# Altium project PCB_Vita.PrjPCB
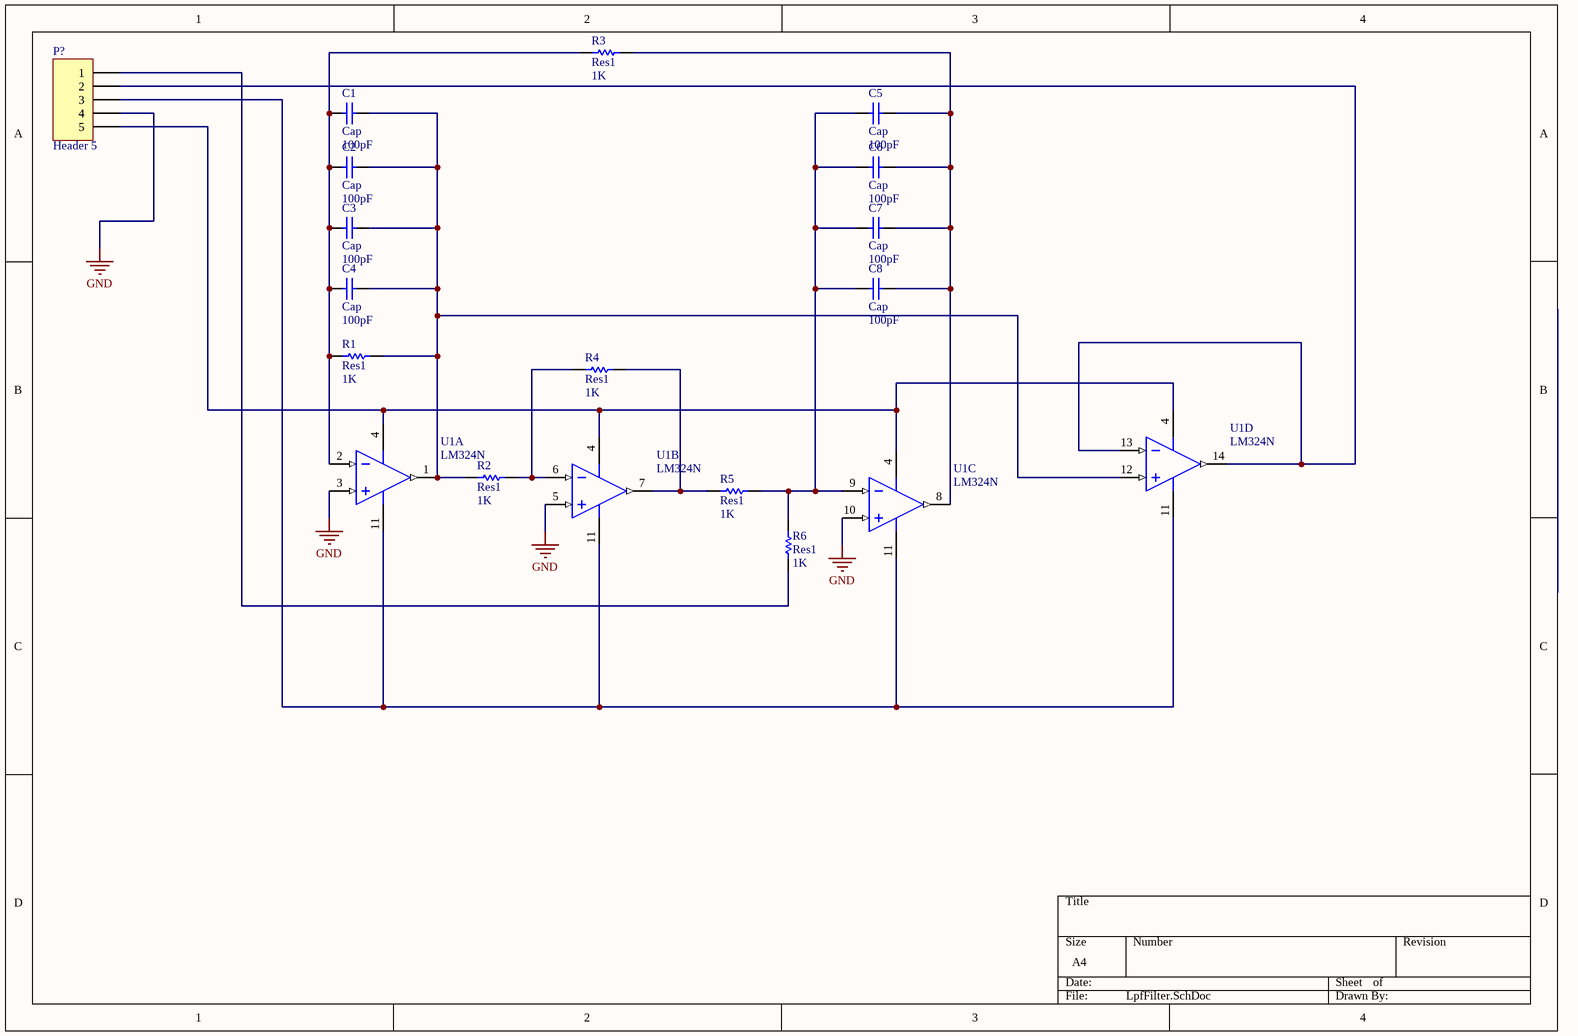
[diagram p0: LpfFilter.SchDoc]
1 sheet, 16 parts. Net scope: global (net labels, ports and power ports of the same name join across sheets).
Board file: LpfFilter.PcbDoc

## Sheet LpfFilter.SchDoc
size A4

### Parts
C1  Cap  value 100pF  [RAD-0.3]
C2  Cap  value 100pF  [RAD-0.3]
C3  Cap  value 100pF  [RAD-0.3]
C4  Cap  value 100pF  [RAD-0.3]
C5  Cap  value 100pF  [RAD-0.3]
C6  Cap  value 100pF  [RAD-0.3]
C7  Cap  value 100pF  [RAD-0.3]
C8  Cap  value 100pF  [RAD-0.3]
P?  Header 5  [HDR1X5]
R1  Res1  value 1K  [AXIAL-0.3]
R2  Res1  value 1K  [AXIAL-0.3]
R3  Res1  value 1K  [AXIAL-0.3]
R4  Res1  value 1K  [AXIAL-0.3]
R5  Res1  value 1K  [AXIAL-0.3]
R6  Res1  value 1K  [AXIAL-0.3]
U1  LM324N  [N14A]  (parts A,B,C,D of 4)

### Nets
GND: P?.4 U1.3(IN1+) U1.5(IN2+) U1.10(IN3+)
NetC1_1: C1.1 C2.1 C3.1 C4.1 R1.1 R3.1 U1.2(IN1-)
NetC1_2: C1.2 C2.2 C3.2 C4.2 R1.2 R2.1 U1.1(OUT1) U1.12(IN4+)
NetC5_1: C5.1 C6.1 C7.1 C8.1 R5.2 R6.2 U1.9(IN3-)
NetC5_2: C5.2 C6.2 C7.2 C8.2 R3.2 U1.8(OUT3)
NetP?_1: P?.1 R6.1
NetP?_2: P?.2 U1.13(IN4-) U1.14(OUT4)
NetP?_3: P?.3 U1.11(GND)
NetP?_5: P?.5 U1.4(V+)
NetR2_2: R2.2 R4.1 U1.6(IN2-)
NetR4_2: R4.2 R5.1 U1.7(OUT2)

### Library data of the parts
C1-C8 = Cap: Capacitor; Published: 8-Jun-2000; LatestRevisionDate: 17-Jul-2002; LatestRevisionNote: Re-released for DXP Platform.; PackageReference: RAD-0.3; Publisher: Altium Limited; PackageDescription: Radial Cap, Thru-Hole; 2 Leads; 0.3 in Pin Spacing
P? = Header 5: Header, 5-Pin; LatestRevisionDate: 17-Jul-2002; LatestRevisionNote: Re-released for DXP Platform.; Publisher: Altium Limited
R1-R6 = Res1: Resistor; Published: 8-Jun-2000; LatestRevisionDate: 17-Jul-2002; LatestRevisionNote: Re-released for DXP Platform.; PackageReference: AXIAL-0.3; Publisher: Altium Limited; PackageDescription: Axial Device, Thru-Hole; 2 Leads; 0.3 in Pin Spacing
U1 = LM324N: Low Power Quad Operational Amplifier, 14-pin MDIP; Manufacturer: National Semiconductor; PackageTopMarking: NSUZXYYTTE#*LM324N; PowerWise: N; CompType: Amplifiers; High-Reliability: Y; DatasheetVersion: Aug-2000; PackageVersion: revG, May-2006; PackageReference: N14A; PackageDescription: MDIP, .750 x .250 x.130in, 14 Lead, .100in Pitch; PartNumber: LM324N; RoHS: N; PinCount: 14; Code_JEDEC: MS-001-AA; ComponentLink1Description: Manufacturer URL; ComponentLink1URL: http://www.national.com/; ComponentLink2Description: LM324 Datasheet; ComponentLink2URL: http://www.national.com/ds/LM/LM324.pdf; ComponentLink3Description: LM324 Web Page; ComponentLink3URL: http://www.national.com/pf/LM/LM324.html; ComponentLink4Description: N14A Package Page; ComponentLink4URL: http://www.national.com/packaging/folders/n14a.html